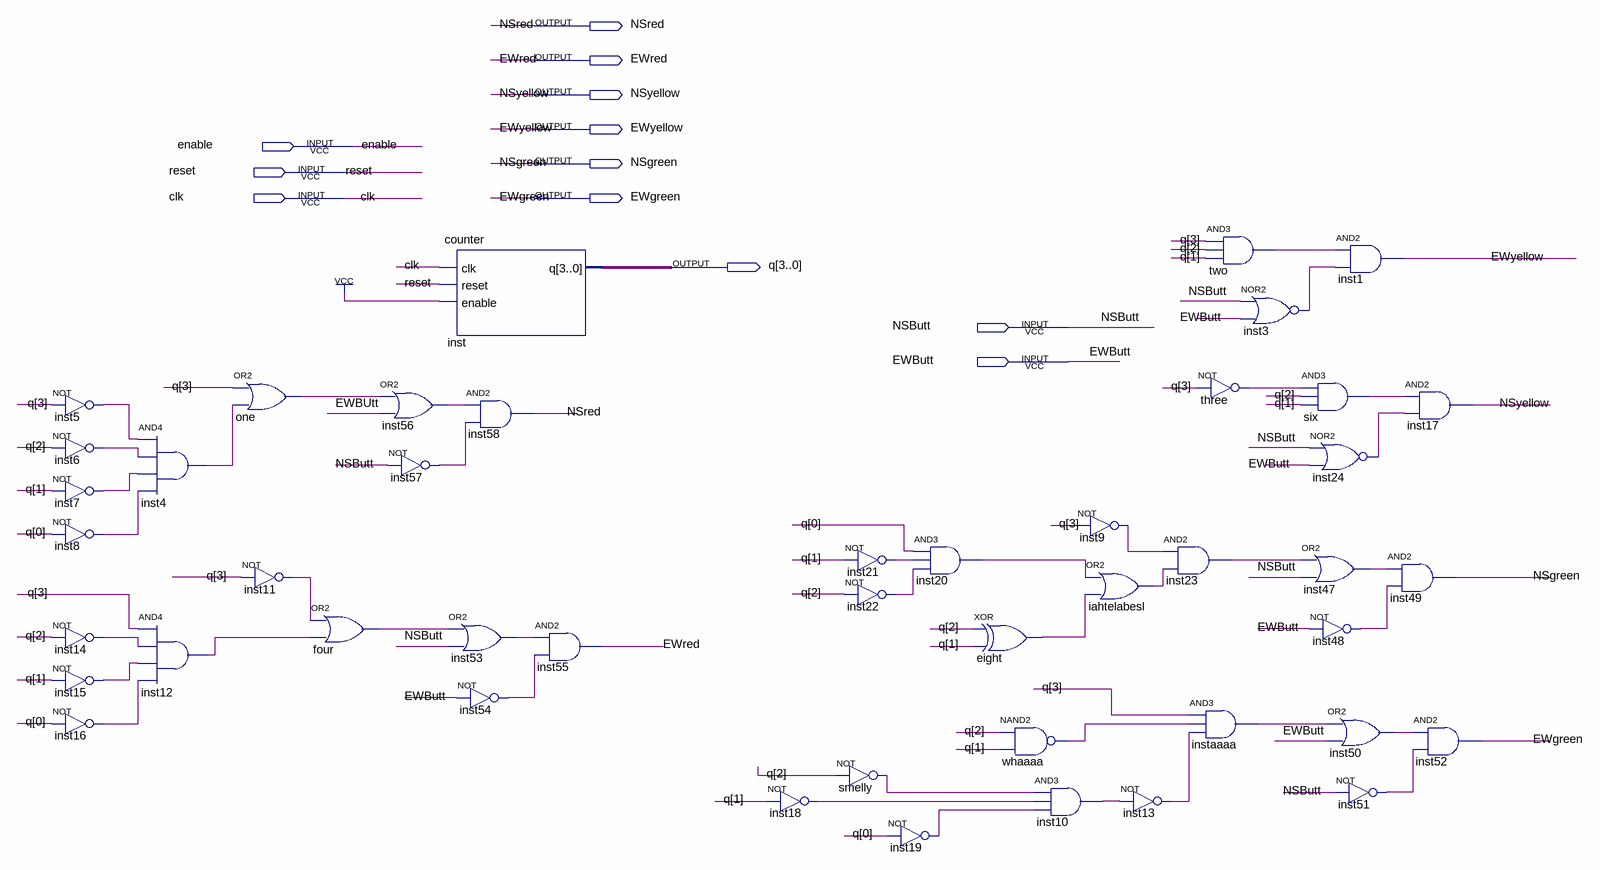
[diagram p0: schematic sheet]
// Quartus schematic traffic2.bdf as structural Verilog: 46 symbols, 12 pins
module traffic2 (
  input  enable,
  input  reset,
  input  clk,
  input  NSButt,
  input  EWButt,
  output NSred,
  output EWred,
  output NSyellow,
  output EWyellow,
  output NSgreen,
  output EWgreen,
  output [3:0] q
);

  wire eight_out, four_out, iahtelabesl_out, inst3_out, inst4_out, inst5_out, inst6_out, inst7_out,
       inst8_out, inst9_out, inst10_out, inst11_out, inst12_out, inst13_out, inst14_out, inst15_out,
       inst16_out, inst18_out, inst19_out, inst20_out, inst21_out, inst22_out, inst23_out, inst24_out,
       inst47_out, inst48_out, inst50_out, inst51_out, inst53_out, inst54_out, inst56_out, inst57_out,
       instaaaa_out, one_out, six_out, smelly_out, three_out, two_out, whaaaa_out;

  not inst5 (inst5_out, q[3]);
  not inst6 (inst6_out, q[2]);
  not inst7 (inst7_out, q[1]);
  not inst8 (inst8_out, q[0]);
  not inst14 (inst14_out, q[2]);
  not inst15 (inst15_out, q[1]);
  not inst16 (inst16_out, q[0]);
  and inst4 (inst4_out, inst5_out, inst6_out, inst7_out, inst8_out);
  and inst12 (inst12_out, q[3], inst14_out, inst15_out, inst16_out);
  or one (one_out, q[3], inst4_out);
  not inst11 (inst11_out, q[3]);
  or four (four_out, inst11_out, inst12_out);
  or inst56 (inst56_out, one_out, EWButt);
  not inst57 (inst57_out, NSButt);
  counter inst (.clk(clk), .reset(reset), .enable(1'b1), .q(q));
  or inst53 (inst53_out, four_out, NSButt);
  not inst54 (inst54_out, EWButt);
  and inst58 (NSred, inst56_out, inst57_out);
  and inst55 (EWred, inst53_out, inst54_out);
  not inst18 (inst18_out, q[1]);
  not inst21 (inst21_out, q[1]);
  not inst22 (inst22_out, q[2]);
  not smelly (smelly_out, q[2]);
  and inst20 (inst20_out, q[0], inst21_out, inst22_out);
  not inst19 (inst19_out, q[0]);
  xor eight (eight_out, q[2], q[1]);
  nand whaaaa (whaaaa_out, q[2], q[1]);
  not inst9 (inst9_out, q[3]);
  and inst10 (inst10_out, smelly_out, inst18_out, inst19_out);
  or iahtelabesl (iahtelabesl_out, inst20_out, eight_out);
  not inst13 (inst13_out, inst10_out);
  and two (two_out, q[3], q[2], q[1]);
  not three (three_out, q[3]);
  and inst23 (inst23_out, inst9_out, iahtelabesl_out);
  and instaaaa (instaaaa_out, q[3], whaaaa_out, inst13_out);
  nor inst3 (inst3_out, NSButt, EWButt);
  and inst1 (EWyellow, two_out, inst3_out);
  and six (six_out, three_out, q[2], q[1]);
  nor inst24 (inst24_out, NSButt, EWButt);
  or inst47 (inst47_out, inst23_out, NSButt);
  not inst48 (inst48_out, EWButt);
  or inst50 (inst50_out, instaaaa_out, EWButt);
  not inst51 (inst51_out, NSButt);
  and inst17 (NSyellow, six_out, inst24_out);
  and inst49 (NSgreen, inst47_out, inst48_out);
  and inst52 (EWgreen, inst50_out, inst51_out);
endmodule
